# Altium schematic sheet Power_2.SchDoc
size A4
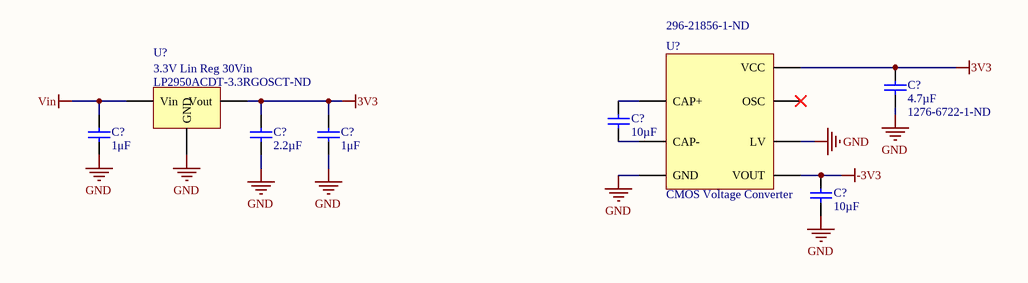
[diagram p0: Power_2.SchDoc]

## Parts
(Parts that share a designator on the sheet are numbered #1, #2 ... from top to bottom, then left to right.)
C?#1  4.7µF  Supplier Part Number 1: 1276-6722-1-ND  [CAPC2012N(0805")]
C?#2  1μF  [CAPC1608N(0603")]
C?#3  2.2µF  [CAPC1608N(0603")]
C?#4  1μF  [CAPC1608N(0603")]
C?#5  10µF  [CAPC3216N(1206")]
C?#6  10µF  [CAPC2012N(0805")]
U?#1  3.3V Lin Reg 30Vin  Supplier Part Number 1: LP2950ACDT-3.3RGOSCT-ND  [T0-252]
U?#2  CMOS Voltage Converter  Supplier Part Number 1: 296-21856-1-ND  [8-SOIC]

## Nets
3V3: C?#1.2(Cathode) C?#3.1(Anode) C?#4.1(Anode) U?#1.3(Vout) U?#2.8(VCC)
-3V3: C?#6.2(Cathode) U?#2.5(VOUT)
GND: C?#1.1(Anode) C?#2.2(Cathode) C?#3.2(Cathode) C?#4.2(Cathode) C?#6.1(Anode) U?#1.1(GND) U?#2.3(GND) U?#2.6(LV)
Vin: C?#2.1(Anode) U?#1.2(Vin)
NetC?#5_1: C?#5.1(Anode) U?#2.4(CAP-)
NetC?#5_2: C?#5.2(Cathode) U?#2.2(CAP+)

Not connected (* = marked no-connect by the designer): U?#2 7(OSC)*

## Library data of the parts
C?#1 = 4.7uF 35V 0805 SMD, Ceramic: Capacitor, Ceramic, 35V, +/- 10%, 0805 SMD, X5R; Made By: Andy Bates; Published: 16-11-12; Publisher: AUVic; PackageDescription: Chip Capacitor; Value: 4.7µF; Supplier 1: Digi-Key
C?#2 C?#4 = 1uF 25V 0603 SMD, Ceramic: Capacitor, Ceramic, 25V, +/- 10%, 0603 SMD, X5R; MFG: Murata-Electronics-North-America; MFG#: GRM188R61E105KA12D; Published: 16-06-27; Publisher: AUVic; PackageDescription: Chip Capacitor; Value: 1μF; Created By: Andy Bates; Supplier 1: Digi-Key; Supplier Part Number 1: 490-3897-1-ND
C?#3 = 2.2uF, 50V, 0603 SMD, X5R, Ceramic: Capacitor, Ceramic, 50V, 10%, 0603 SMD, X5R; Date Created: *; PackageDescription: Chip Capacitor; Value: 2.2µF; Made By: *; Publisher: AUVic; Supplier 1: Digi-Key; Supplier Part Number 1: 490-10733-1-ND
C?#5 = 10uF 50V 1206 SMD, Ceramic: Capacitor, Ceramic, 50V, +/- 10%, 1206 SMD, X5R; Published: 14-06-01; Publisher: AUVic; PackageDescription: Chip Capacitor; Value: 10µF; Supplier 1: Digi-Key; Supplier Part Number 1: 1276-2876-1-ND
C?#6 = 10uF 10V 0805 SMD, Ceramic: Capacitor, Ceramic, 10V, +/- 10%, 0805 SMD, X5R; Made By: Andy Bates; Published: 14-06-23; Publisher: AUVic; PackageDescription: Chip Capacitor; Value: 10µF; Supplier 1: Digi-Key; Supplier Part Number 1: 490-4735-1-ND
U?#1 = 3.3V TO-252 Linear Regulator: Supplier 1: Digi-Key
U?#2 = TL7660: LatestRevisionDate: 17-Jul-2002; LatestRevisionNote: Re-released for DXP Platform.; Publisher: Altium Limited; Created By: Jordan; Manufacturer Part No.: TL7660; Supplier 1: Digi-Key